# EAGLE design iit_hawkrod_front_board (EAGLE 9.6.2)
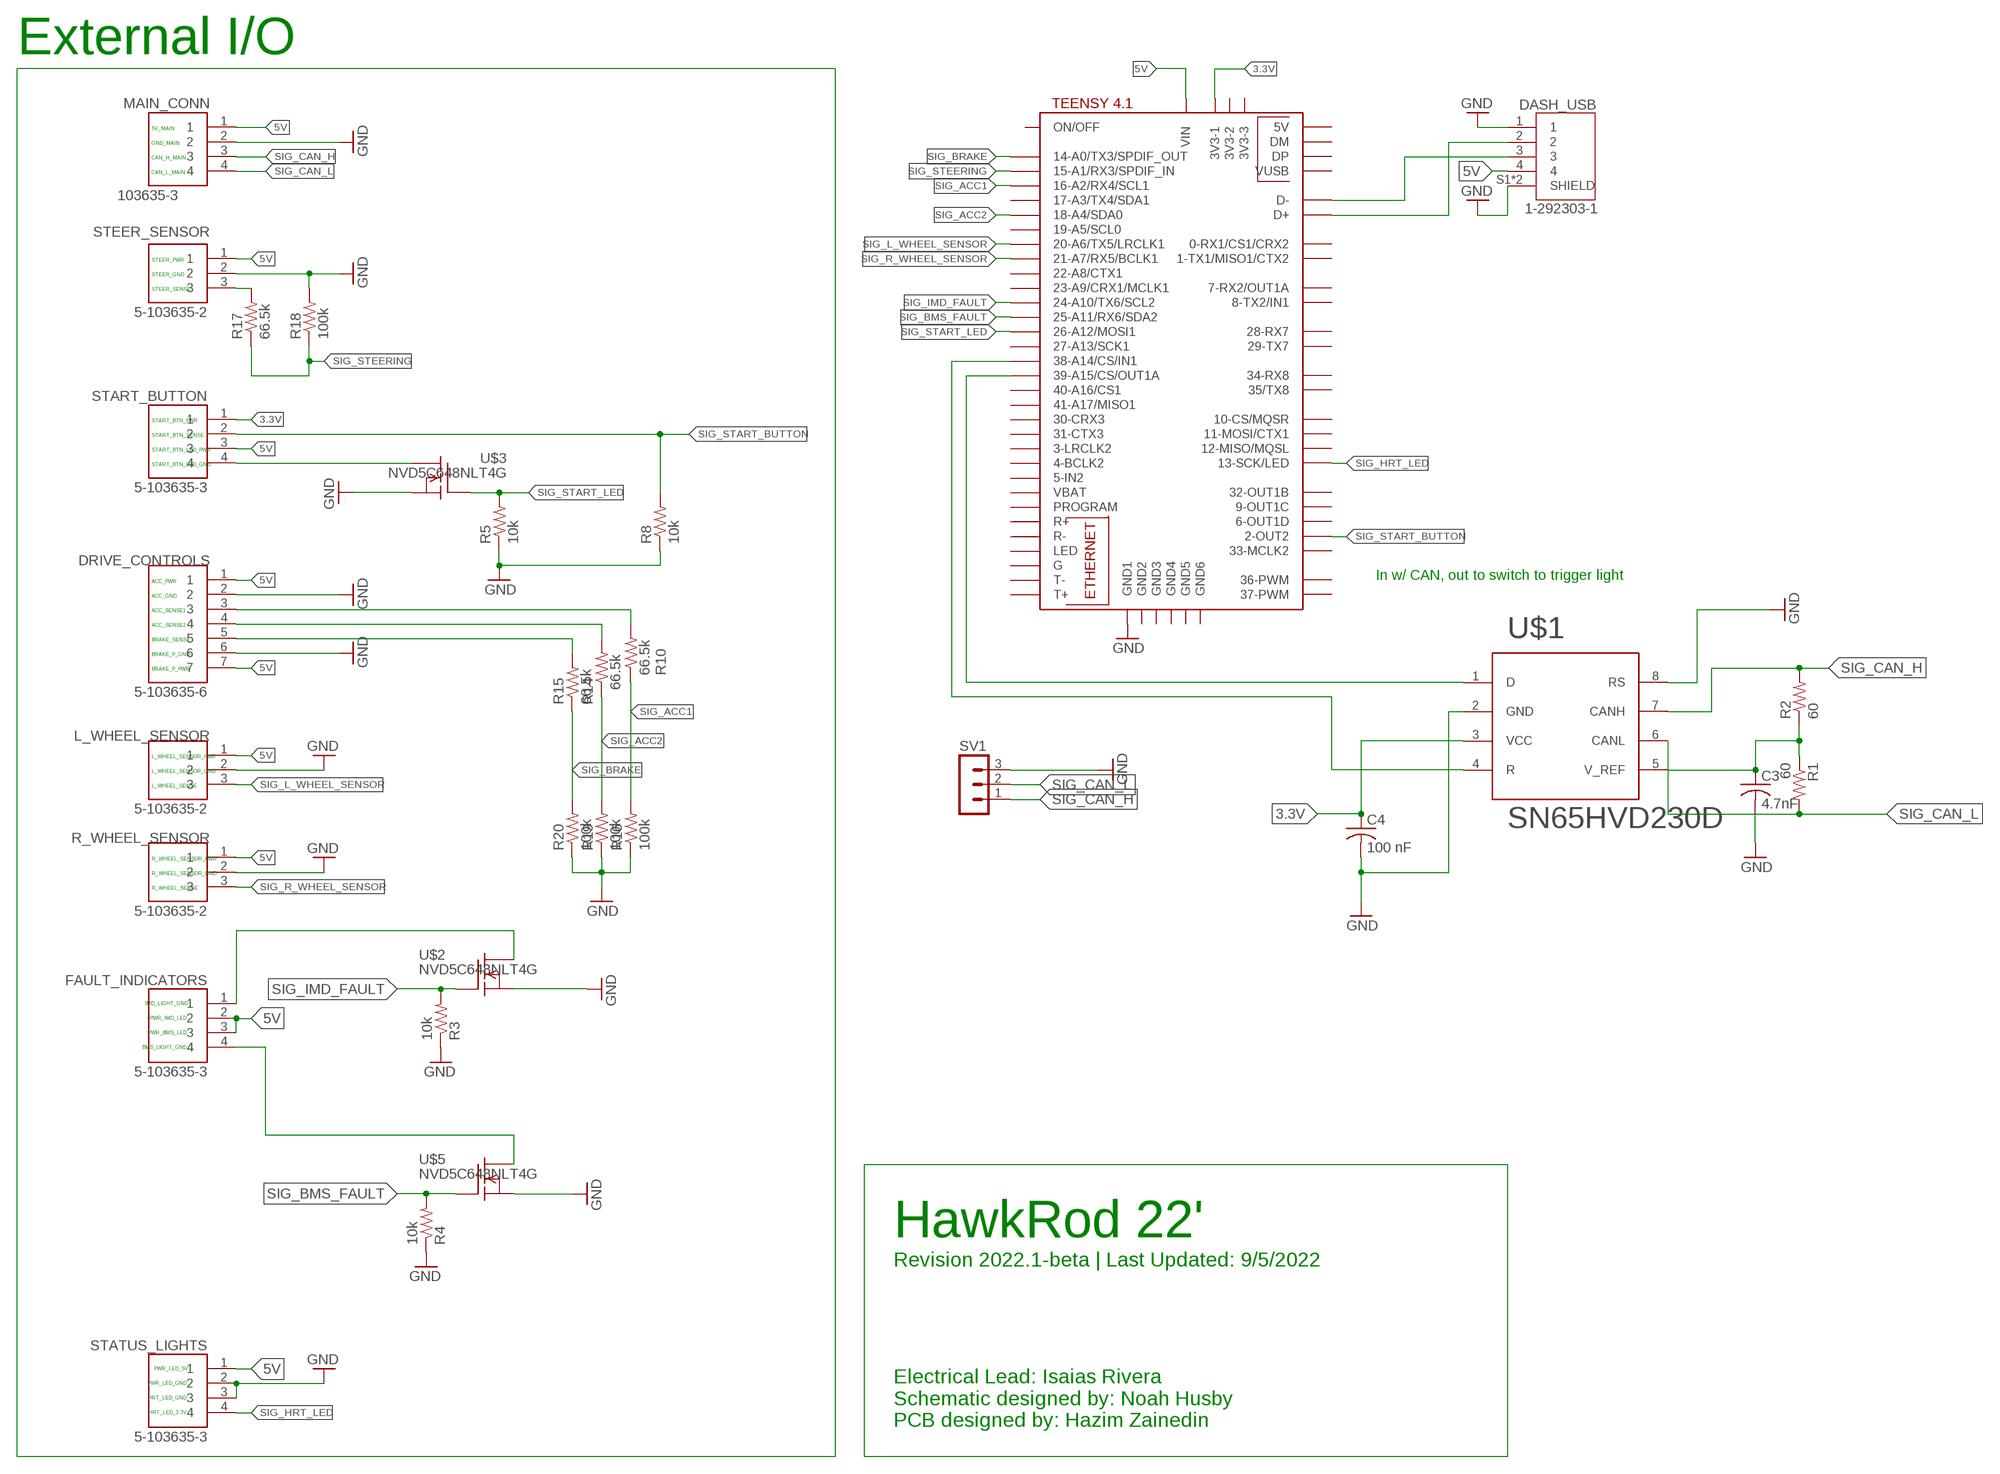
[diagram p0: schematic, sheet 1]

## Parts
C3  4.7nF  C-USC1206  [C1206]
C4  100 nF  C-USC1206  [C1206]
DASH_USB  1-292303-1  [TE_1-292303-1]
DRIVE_CONTROLS  5-103635-6  [TE_5-103635-6]
FAULT_INDICATORS  5-103635-3  [TE_5-103635-3]
L_WHEEL_SENSOR  5-103635-2  [TE_5-103635-2]
MAIN_CONN  103635-3  [TE_103635-3]
R1  60  R-US_R1206  [R1206]
R2  60  R-US_R1206  [R1206]
R3  10k  R-US_R1206  [R1206]
R4  10k  R-US_R1206  [R1206]
R5  10k  R-US_R1206  [R1206]
R8  10k  R-US_R1206  [R1206]
R10  66.5k  R-US_R1206  [R1206]
R14  66.5k  R-US_R1206  [R1206]
R15  66.5k  R-US_R1206  [R1206]
R16  100k  R-US_R1206  [R1206]
R17  66.5k  R-US_R1206  [R1206]
R18  100k  R-US_R1206  [R1206]
R19  100k  R-US_R1206  [R1206]
R20  100k  R-US_R1206  [R1206]
R_WHEEL_SENSOR  5-103635-2  [TE_5-103635-2]
START_BUTTON  5-103635-3  [TE_5-103635-3]
STATUS_LIGHTS  5-103635-3  [TE_5-103635-3]
STEER_SENSOR  5-103635-2  [TE_5-103635-2]
SV1  MA03-1  [MA03-1]
U$1  SN65HVD230D  [R-PDSO-8]
U$2  NVD5C648NLT4G  [DPAK]
U$3  NVD5C648NLT4G  [DPAK]
U$5  NVD5C648NLT4G  [DPAK]
U$6  TEENSY41  [TEENSY41]

## Nets
3.3V: C4.1 START_BUTTON.1 U$1.3(VCC) U$6.3V3-1
5V: DASH_USB.4 DRIVE_CONTROLS.1 DRIVE_CONTROLS.7 FAULT_INDICATORS.2 FAULT_INDICATORS.3 L_WHEEL_SENSOR.1 MAIN_CONN.1 R_WHEEL_SENSOR.1 START_BUTTON.3 STATUS_LIGHTS.1 STEER_SENSOR.1 U$6.VIN
GND: C3.2 C4.2 DASH_USB.1 DASH_USB.S1(SHIELD) DASH_USB.S2(SHIELD) DRIVE_CONTROLS.2 DRIVE_CONTROLS.6 L_WHEEL_SENSOR.2 MAIN_CONN.2 R3.1 R4.1 R5.1 R8.1 R16.1 R18.2 R19.1 R20.1 R_WHEEL_SENSOR.2 STATUS_LIGHTS.2 STATUS_LIGHTS.3 STEER_SENSOR.2 SV1.3 U$1.2(GND) U$1.8(RS) U$2.3(S) U$3.3(S) U$5.3(S) U$6.GND1
N$1: U$1.1(D) U$6.39-A15/CS/OUT1A
N$2: R2.2 U$1.7(CANH)
N$3: C3.1 R1.1 R2.1 U$1.5(V_REF)
N$4: FAULT_INDICATORS.1 U$2.4(D)
N$5: R1.2 U$1.6(CANL)
N$6: U$1.4(R) U$6.38-A14/CS/IN1
N$7: START_BUTTON.4 U$3.4(D)
N$8: FAULT_INDICATORS.4 U$5.4(D)
N$9: DRIVE_CONTROLS.3 R10.2
N$10: DRIVE_CONTROLS.4 R14.2
N$13: DASH_USB.3 U$6.D-
N$14: DRIVE_CONTROLS.5 R15.2
N$15: R17.2 STEER_SENSOR.3
N$16: DASH_USB.2 U$6.D+
SIG_ACC1: R10.1 R16.2 U$6.16-A2/RX4/SCL1
SIG_ACC2: R14.1 R19.2 U$6.18-A4/SDA0
SIG_BMS_FAULT: R4.2 U$5.1(G) U$6.25-A11/RX6/SDA2
SIG_BRAKE: R15.1 R20.2 U$6.14-A0/TX3/SPDIF_OUT
SIG_CAN_H: MAIN_CONN.3 SV1.1
SIG_CAN_L: MAIN_CONN.4 SV1.2
SIG_HRT_LED: STATUS_LIGHTS.4 U$6.13-SCK/LED
SIG_IMD_FAULT: R3.2 U$2.1(G) U$6.24-A10/TX6/SCL2
SIG_L_WHEEL_SENSOR: L_WHEEL_SENSOR.3 U$6.20-A6/TX5/LRCLK1
SIG_R_WHEEL_SENSOR: R_WHEEL_SENSOR.3 U$6.21-A7/RX5/BCLK1
SIG_START_BUTTON: R8.2 START_BUTTON.2 U$6.2-OUT2
SIG_START_LED: R5.2 U$3.1(G) U$6.26-A12/MOSI1
SIG_STEERING: R17.1 R18.1 U$6.15-A1/RX3/SPDIF_IN
Unconnected: U$6.0-RX1/CS1/CRX2 U$6.1-TX1/MISO1/CTX2 U$6.3-LRCLK2 U$6.3V3-2 U$6.3V3-3 U$6.4-BCLK2 U$6.5-IN2 U$6.6-OUT1D U$6.7-RX2/OUT1A U$6.8-TX2/IN1 U$6.9-OUT1C U$6.10-CS\MQSR(10-CS/MQSR) U$6.11-MOSI/CTX1 U$6.12-MISO/MQSL U$6.17-A3/TX4/SDA1 U$6.19-A5/SCL0 U$6.22-A8/CTX1 U$6.23-A9/CRX1/MCLK1 U$6.27-A13/SCK1 U$6.28-RX7 U$6.29-TX7 U$6.30-CRX3 U$6.31-CTX3 U$6.32-OUT1B U$6.33-MCLK2 U$6.34-RX8 U$6.35-TX8(35/TX8) U$6.36-PWM U$6.37-PWM U$6.40-A16/CS1 U$6.41-A17/MISO1 U$6.+5V(5V) U$6.DM U$6.DP U$6.G U$6.GND2 U$6.GND3 U$6.GND4 U$6.GND5 U$6.GND6 U$6.LED U$6.ON/OFF U$6.PROGRAM U$6.R+ U$6.R- U$6.T+ U$6.T- U$6.VBAT U$6.VUSB

## Notes on the sheet
- External I/O
- 5V_MAIN
- GND_MAIN
- CAN_H_MAIN
- CAN_L_MAIN
- STEER_PWR
- STEER_GND
- STEER_SENSE
- START_BTN_PWR
- START_BTN_SENSE
- START_BTN_LED_PWR
- START_BTN_LED_GND
- In w/ CAN, out to switch to trigger light
- ACC_PWR
- ACC_GND
- ACC_SENSE1
- ACC_SENSE2
- BRAKE_SENSE
- BRAKE_P_GND
- BRAKE_P_PWR
- L_WHEEL_SENSOR_PWR
- L_WHEEL_SENSOR_GND
- L_WHEEL_SENSE
- R_WHEEL_SENSOR_PWR
- R_WHEEL_SENSOR_GND
- R_WHEEL_SENSE
- IMD_LIGHT_GND
- PWR_IMD_LED
- PWR_BMS_LED
- BMS_LIGHT_GND
- HawkRod 22'
- Revision 2022.1-beta | Last Updated: 9/5/2022
- PWR_LED_5V
- PWR_LED_GND
- HRT_LED_GND
- HRT_LED_3.3V
- Electrical Lead: Isaias Rivera
  Schematic designed by: Noah Husby
  PCB designed by: Hazim Zainedin

## Library data of the parts
C3 C4 = rcl:C-US: CAPACITOR, American symbol; SPICEPREFIX: C
DASH_USB = 1-292303-1:1-292303-1: Conn USB 2.0 Type A RCP 4 POS Solder RA SMD 4 Terminal 1 Port Box/Tray Check availability <https://pricing.snapeda.com/parts/1-292303-1/TE%20Connectivity/view-part?ref=eda>; AVAILABILITY: In Stock; COMMENT: 1-292303-1; DESCRIPTION: Conn USB 2.0 Type A RCP 4 POS Solder RA SMD 4 Terminal 1 Port Box/Tray; EU_ROHS_COMPLIANCE: Compliant; MF: TE Connectivity; MP: 1-292303-1; PACKAGE: None; PRICE: None; PURCHASE-URL: https://pricing.snapeda.com/search/part/1-292303-1/?ref=eda
DRIVE_CONTROLS = 5-103635-6:5-103635-6: Check availability <https://pricing.snapeda.com/parts/5-103635-6/TE%20Connectivity/view-part?ref=eda>; AVAILABILITY: In Stock; COMMENT: 5-103635-6; DESCRIPTION: 07 MTE HDR SRRA LTCH.100CL LF; MF: TE Connectivity; MP: 5-103635-6; PACKAGE: None; PRICE: None; PURCHASE-URL: https://pricing.snapeda.com/search/part/5-103635-6/?ref=eda
FAULT_INDICATORS START_BUTTON STATUS_LIGHTS = 5-103635-3:5-103635-3: Header, Through Hole; Shrouded; Right Angle; Brass; Thermoplastic; 4; 0.1 in. Check availability <https://pricing.snapeda.com/parts/5-103635-3/TE%20Connectivity/view-part?ref=eda>; AVAILABILITY: In Stock; COMMENT: 5-103635-3; DESCRIPTION: Header, Through Hole; Shrouded; Right Angle; Brass; Thermoplastic; 4; 0.1 in.; EU_ROHS_COMPLIANCE: Compliant; MF: TE Connectivity; MP: 5-103635-3; PACKAGE: None; PRICE: None; PURCHASE-URL: https://pricing.snapeda.com/search/part/5-103635-3/?ref=eda
L_WHEEL_SENSOR R_WHEEL_SENSOR STEER_SENSOR = 5-103635-2:5-103635-2: Check availability <https://pricing.snapeda.com/parts/5-103635-2/TE%20Connectivity/view-part?ref=eda>; AVAILABILITY: In Stock; COMMENT: 5-103635-2; DESCRIPTION: AMPMODU 3 Position 2.54 mm Single Row Through-Hole Right Angle Header; EU_ROHS_COMPLIANCE: Compliant; MF: TE Connectivity; MP: 5-103635-2; PACKAGE: None; PRICE: None; PURCHASE-URL: https://pricing.snapeda.com/search/part/5-103635-2/?ref=eda
MAIN_CONN = 103635-3:103635-3: Check availability <https://pricing.snapeda.com/parts/103635-3/TE%20Connectivity/view-part?ref=eda>; AVAILABILITY: In Stock; COMMENT: 103635-3; DESCRIPTION: 04 MTE HDR SRRA LATCH .100CL; MF: TE Connectivity; MP: 103635-3; PACKAGE: None; PRICE: None; PURCHASE-URL: https://pricing.snapeda.com/search/part/103635-3/?ref=eda
R1-R5 R8 R10 R14-R20 = rcl:R-US_: RESISTOR, American symbol; SPICEPREFIX: R
SV1 = con-lstb:MA03-1: PIN HEADER; OC_FARNELL: unknown; OC_NEWARK: unknown
U$1 = SAE_2019:SN65HVD230D: SN65HVD230 TI - 3.3-V CAN Bus Transceivers
U$2 U$3 U$5 = SAE_2019:NVD5C648NLT4G: NVD5C648NLT4G ON Semi - Power MOSFET 60 V, 4.1 m, 89 A, Single N−Channel
U$6 = teensy:TEENSY41

## Net classes
0 default: width 0.406 mm, drill 0.45 mm, clearance 0.3 mm

## Board
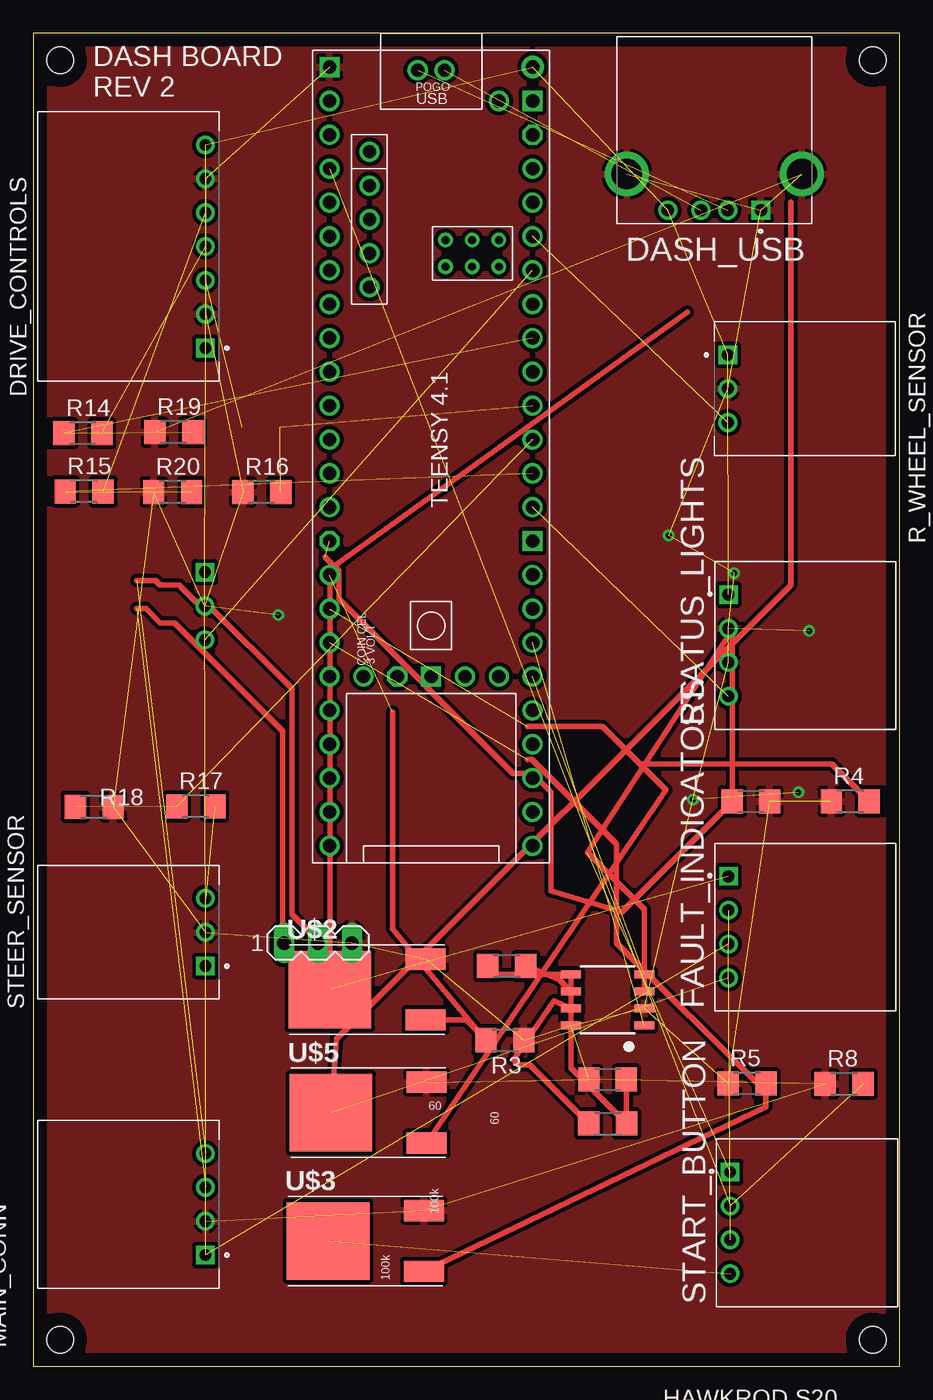
[diagram p1: board, top side]
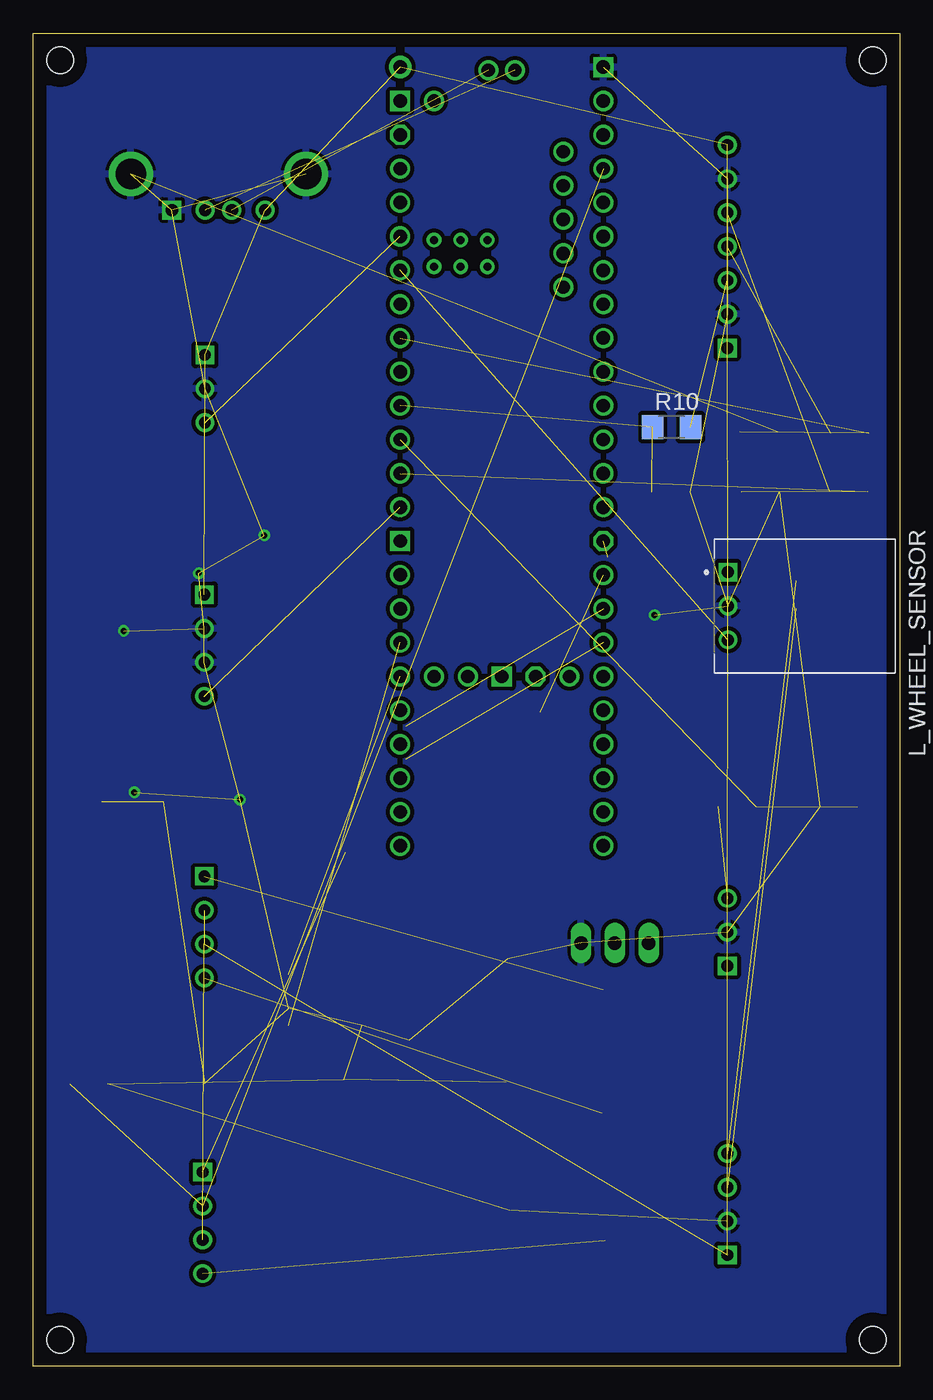
[diagram p2: board, bottom side, seen from below]

Size 65 x 100 mm. Coordinates in mm from the lower left corner, seen from the top.
Outline: 0,0 65,0 65,100 0,100 0,0
Copper layers (1*16): Top 0.035mm / dielectric 1.5mm / Bottom 0.035mm
Design rules "default": minimum track width 6mil, minimum drill 0.35mm, track to track 6mil, track to pad 6mil, pad to pad 6mil, via to via 6mil, smd to smd 6mil, copper to edge 40mil, drill to drill 6mil, minimum pad ring 10mil, minimum via ring 8mil, stop-mask expansion 4mil, vias tented up to drill 0mil, thermal gap 10mil
Holes 2 mm at 2,2 63,2 63,98 2,98

### Footprints (pad centres in the part's own frame; a part is rotated, then mirrored left to right if it is on the bottom)
C1206 = smd 1.6 x 1.8: 1 -1.4,0; 2 1.4,0
TE_1-292303-1 = drill 0.92 square: 1 -3.5,5.99 | drill 0.92: 2 -1,5.99; 3 1,5.99; 4 3.5,5.99 | drill 2.3: S1 -6.57,3.28; S2 6.57,3.28
TE_5-103635-6 = drill 0.89 square: 1 -7.62,0 | drill 0.89: 2 -5.08,0; 3 -2.54,0; 4 0,0; 5 2.54,0; 6 5.08,0; 7 7.62,0
TE_5-103635-3 = drill 0.89 square: 1 3.81,0 | drill 0.89: 2 1.27,0; 3 -1.27,0; 4 -3.81,0
TE_5-103635-2 = drill 0.89 square: 1 -2.54,0 | drill 0.89: 2 0,0; 3 2.54,0
TE_103635-3 = drill 0.89 square: 1 -3.81,0 | drill 0.89: 2 -1.27,0; 3 1.27,0; 4 3.81,0
R1206 = smd 1.6 x 1.803: 1 -1.422,0; 2 1.422,0
MA03-1 = drill 1.016 long: 1 -2.54,0; 2 0,0; 3 2.54,0
R-PDSO-8 = smd 0.6 x 1.5: 1 -1.905,-2.75; 2 -0.635,-2.75; 3 0.635,-2.75; 4 1.905,-2.75; 5 1.905,2.75; 6 0.635,2.75; 7 -0.635,2.75; 8 -1.905,2.75
DPAK = smd 3 x 1.6: 1 2.79,-2.285; 3 2.79,2.285 | smd 6.2 x 5.8: 4 -4.39,0
TEENSY41 = drill 1: 0-RX1/CS1/CRX2 -27.94,-7.62; 1-TX1/MISO1/CTX2 -25.4,-7.62; 2-OUT2 -22.86,-7.62; 3-LRCLK2 -20.32,-7.62; 4-BCLK2 -17.78,-7.62; 5-IN2 -15.24,-7.62; 6-OUT1D -12.7,-7.62; 7-RX2/OUT1A -10.16,-7.62; 8-TX2/IN1 -7.62,-7.62; 9-OUT1C -5.08,-7.62; 10-CS\MQSR -2.54,-7.62; 11-MOSI/CTX1 0,-7.62; 12-MISO/MQSL 2.54,-7.62; 13-SCK/LED 2.54,7.62; 14-A0/TX3/SPDIF_OUT 0,7.62; 15-A1/RX3/SPDIF_IN -2.54,7.62; 16-A2/RX4/SCL1 -5.08,7.62; 17-A3/TX4/SDA1 -7.62,7.62; 18-A4/SDA0 -10.16,7.62; 19-A5/SCL0 -12.7,7.62; 20-A6/TX5/LRCLK1 -15.24,7.62; 21-A7/RX5/BCLK1 -17.78,7.62; 22-A8/CTX1 -20.32,7.62; 23-A9/CRX1/MCLK1 -22.86,7.62; 24-A10/TX6/SCL2 7.62,-7.62; 25-A11/RX6/SDA2 10.16,-7.62; 26-A12/MOSI1 12.7,-7.62; 27-A13/SCK1 15.24,-7.62; 28-RX7 17.78,-7.62; 29-TX7 20.32,-7.62; 30-CRX3 22.86,-7.62; 31-CTX3 25.4,-7.62; 32-OUT1B 27.94,-7.62; 33-MCLK2 27.94,7.62; 34-RX8 25.4,7.62; 35-TX8 22.86,7.62; 36-PWM 20.32,7.62; 37-PWM 17.78,7.62; 38-A14/CS/IN1 15.24,7.62; 39-A15/CS/OUT1A 12.7,7.62; 40-A16/CS1 10.16,7.62; 41-A17/MISO1 7.62,7.62; +5V -24.13,-4.62; D+ -30.25,-1; D- -30.25,1; DM -21.59,-4.62; DP -19.05,-4.62; GND4 -16.51,-4.62; GND5 -13.97,-4.62; ON/OFF 15.24,5.08; PROGRAM 15.24,2.54; VBAT 15.24,-5.08; VUSB -27.94,5.08 | drill 1 octagon: 3V3-1 5.08,-7.62; 3V3-2 15.24,-2.54; 3V3-3 -25.4,7.62 | drill 0.6: G -15.51,3.08; LED -17.51,3.08; R+ -17.51,5.08; R- -15.51,5.08; T+ -15.51,1.08; T- -17.51,1.08 | drill 1 square: GND1 -30.48,-7.62; GND2 15.24,0; GND3 5.08,7.62; GND6 -27.94,7.62 | drill 1 pad 1.676: VIN -30.48,7.62

### Placement (x,y rotation side)
C3  43.1,21.51 180 top
C4  53.85,42.38 0 top
DASH_USB  51.11,92.73 180 top
DRIVE_CONTROLS  12.91,84.01 90 top
FAULT_INDICATORS  52.17,32.94 90 top
L_WHEEL_SENSOR  12.87,57.03 270 bottom
MAIN_CONN  12.91,12.15 90 top
R1  35.53,30.02 0 top
R2  43.1,18.2 180 top
R3  35.39,24.46 180 top
R4  61.3,42.37 0 top
R5  53.55,21.2 0 top
R8  60.85,21.17 0 top
R10  17.11,70.46 0 bottom
R14  3.73,69.99 0 top
R15  3.81,65.63 0 top
R16  17.15,65.59 0 top
R17  12.19,42 0 top
R18  4.57,41.96 0 top
R19  10.54,70.08 0 top
R20  10.46,65.59 0 top
R_WHEEL_SENSOR  52.12,73.34 270 top
START_BUTTON  52.29,10.75 90 top
STATUS_LIGHTS  52.17,54.07 90 top
STEER_SENSOR  12.91,32.56 90 top
SV1  21.36,31.75 0 top
U$1  43.1,27.48 90 top
U$2  26.64,28.26 0 top
U$3  26.51,9.4 0 top
U$5  26.73,19.02 0 top
U$6  29.85,66.98 270 top

### Tracks (layer width: path | path; a pad name or v marks a point on that pad's centre or on a via)
3.3V  (2 unrouted)
  Top 0.406: U$1.3 45.85,34.29 41.58,38.55 52.45,55.28 C4.1 44.16,34.09 38.83,35.65 38.83,43.07 37.42,44.48 36.01,44.48 22.95,57.54 22.95,59.66 21.89,60.72
5V  (11 unrouted)
GND  (via drill 0.45)  (33 unrouted)
  other vias: 18.38,56.36 47.68,62.33 52.59,59.49 58.22,55.17 49.5,42.51 57.42,43.06
  pour Bottom: -9,101.25 73.5,101.25 73.5,-7.5 -8.25,-7.5 -9,-6.75
  pour Top: -10.5,102 74.25,102 74.25,-8.25 -10.5,-8.25
N$1  (1 unrouted)
N$2
  Top 0.406: U$1.7 39.08,27.41 36.02,22.97 36.4,22.59 37.29,22.59 R2.2
N$3
  Top 0.406: C3.1 44.52,21.49 R2.1 40.35,22.38 U$1.5 34.74,29.38 R1.1
N$4  (1 unrouted)
  Top 0.406: U$2.4 22.25,59.81 49.07,79.07
N$5
  Top 0.406: U$1.6 39.45,29.01 R1.2
N$6  (1 unrouted)
N$7  (1 unrouted)
N$8  (1 unrouted)
  Top 0.406: 56.83,87.33 56.83,58.6 22.77,24.54 U$5.4
N$9  (1 unrouted)
N$10  (1 unrouted)
N$13  (1 unrouted)
N$14  (1 unrouted)
N$15  (1 unrouted)
N$16  (1 unrouted)
SIG_ACC1  (2 unrouted)
SIG_ACC2  (2 unrouted)
SIG_BMS_FAULT  (1 unrouted)
  Top 0.406: R4.2 59.91,45.18 45.54,45.18 | U$5.1 47.48,43.25 45.54,45.18 | 37.06,48.01 42.71,48.01 45.54,45.18
SIG_BRAKE  (2 unrouted)
SIG_CAN_H  (1 unrouted)
  Top 0.406: 7.77,56.83 8.47,56.83 9.53,55.77 10.59,55.77 18.71,47.66 18.71,31.77 SV1.1
SIG_CAN_L  (1 unrouted)
  Top 0.406: 7.77,58.95 9.18,58.95 9.53,58.6 10.94,58.6 12.36,57.19 13.06,57.19 19.41,50.83 19.41,33.89 21.53,31.77 SV1.2
SIG_HRT_LED  (1 unrouted)
SIG_IMD_FAULT  (1 unrouted)
  Top 0.406: 26.95,49.1 26.95,32.81 R3.2 32.45,25.98 U$2.1
SIG_L_WHEEL_SENSOR  (1 unrouted)
SIG_R_WHEEL_SENSOR  (1 unrouted)
SIG_START_BUTTON  (2 unrouted)
SIG_START_LED  (1 unrouted)
  Top 0.406: U$3.1 54.98,19.44 R5.2 54.86,20.68 43.77,31.77 43.77,39.18 37.42,45.54 37.06,45.54
SIG_STEERING  (2 unrouted)

### Text on the board
tPlace: DASH BOARD / REV 2 | Illinois Institute of Technology | 60 | 60 | 100k | 100k | HAWKROD S20 | IIT MOTORSPORTS | DESIGNED BY: IIT SAE